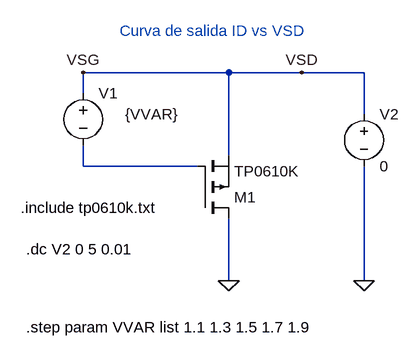
[diagram p0: schematic sim_pmos_salida.asc]
sim_pmos_salida.asc, the LTspice schematic file:
Version 4
SHEET 1 880 680
WIRE -448 -144 -672 -144
WIRE -336 -144 -448 -144
WIRE -240 -144 -336 -144
WIRE -672 -112 -672 -144
WIRE -240 -80 -240 -144
WIRE -448 -16 -448 -144
WIRE -672 0 -672 -32
WIRE -496 0 -672 0
WIRE -448 176 -448 80
WIRE -240 176 -240 0
FLAG -672 -144 VSG
FLAG -336 -144 VSD
FLAG -448 176 0
FLAG -240 176 0
SYMBOL voltage -672 -128 R0
WINDOW 123 0 0 Left 0
WINDOW 39 0 0 Left 0
WINDOW 3 65 48 Left 2
SYMATTR Value {VVAR}
SYMATTR InstName V1
SYMBOL voltage -240 -96 R0
WINDOW 123 0 0 Left 0
WINDOW 39 0 0 Left 0
SYMATTR InstName V2
SYMATTR Value 0
SYMBOL pmos -496 80 M180
SYMATTR InstName M1
SYMATTR Value TP0610K
SYMATTR Prefix X
TEXT -768 64 Left 2 !.include tp0610k.txt
TEXT -760 128 Left 2 !.dc V2 0 5 0.01
TEXT -616 -208 Left 2 ;Curva de salida ID vs VSD
TEXT -760 248 Left 2 !.step param VVAR list 1.1 1.3 1.5 1.7 1.9

The netlist it stands for:
* sim_pmos_salida.asc
V1 VSD N001 {VVAR}
V2 VSD 0 0
XM1 0 N001 VSD TP0610K  ; pins D G S
.include tp0610k.txt
.dc V2 0 5 0.01
* Curva de salida ID vs VSD
.step param VVAR list 1.1 1.3 1.5 1.7 1.9
.backanno
.end